# EAGLE design Small_LED_Cube (EAGLE 7.7.0)
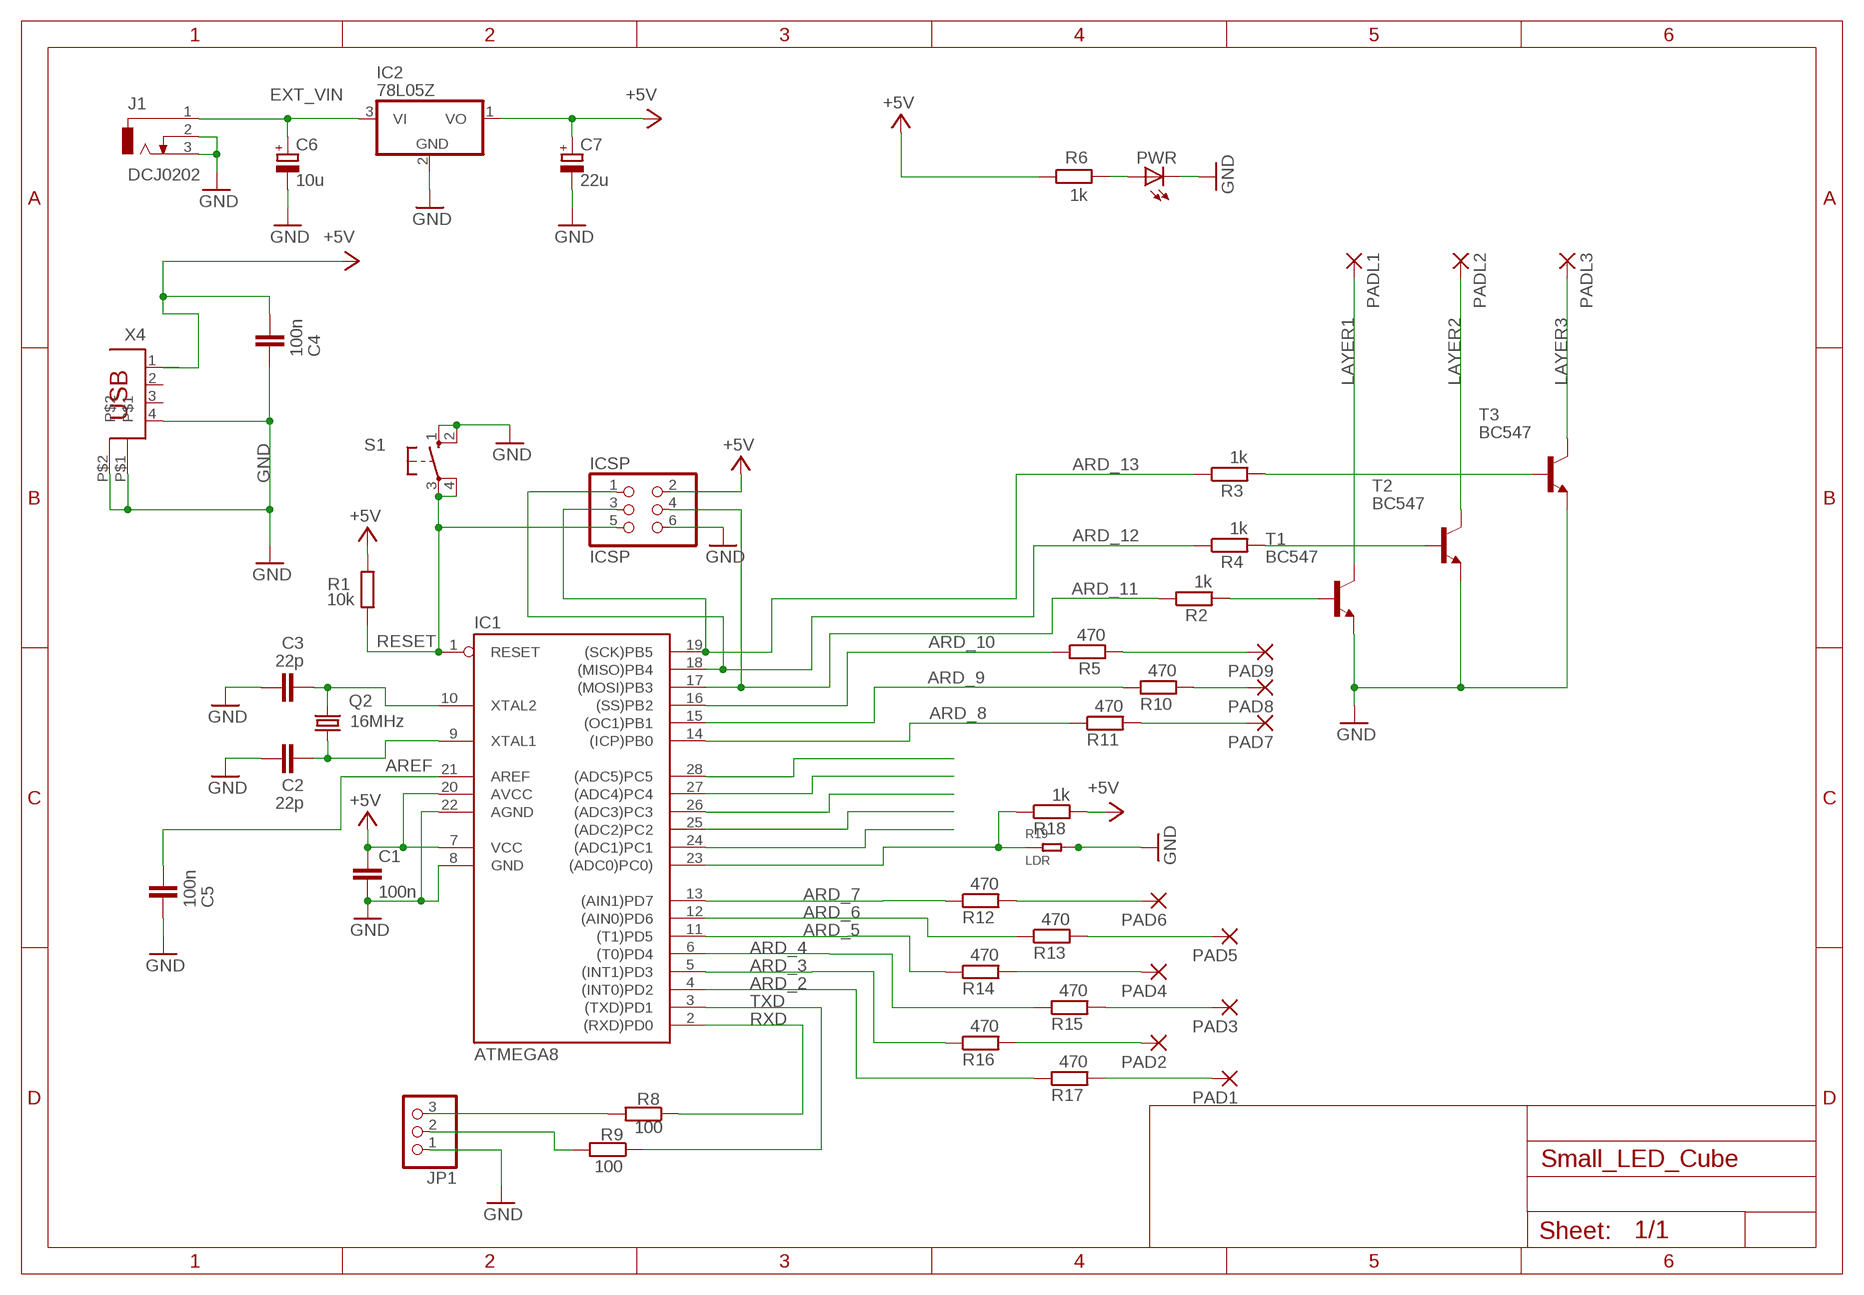
[diagram p0: schematic, sheet 1]

## Parts
C1  100n  C-EU050-025X075  [C050-025X075]
C2  22p  C-EU025-024X044  [C025-024X044]
C3  22p  C-EU025-024X044  [C025-024X044]
C4  100n  C-EU050-025X075  [C050-025X075]
C5  100n  C-EU050-025X075  [C050-025X075]
C6  10u  CPOL-EUE2.5-5  [E2,5-5]
C7  22u  CPOL-EUE2.5-5  [E2,5-5]
IC1  ATMEGA8  AT90S4433P  [DIL28-3]
IC2  78L05Z  [TO92]
ICSP  ICSP  PINHD-2X3  [2X03]
J1  DCJ0202  [DCJ0202]
JP1  PINHD-1X3  [1X03]
PAD1  1,6/0,9  [1,6/0,9]
PAD2  1,6/0,9  [1,6/0,9]
PAD3  1,6/0,9  [1,6/0,9]
PAD4  1,6/0,9  [1,6/0,9]
PAD5  1,6/0,9  [1,6/0,9]
PAD6  1,6/0,9  [1,6/0,9]
PAD7  1,6/0,9  [1,6/0,9]
PAD8  1,6/0,9  [1,6/0,9]
PAD9  1,6/0,9  [1,6/0,9]
PADL1  1,6/0,9  [1,6/0,9]
PADL2  1,6/0,9  [1,6/0,9]
PADL3  1,6/0,9  [1,6/0,9]
PWR  LED3MM  [LED3MM]
Q2  16MHz  CRYTALHC49S  [HC49/S]
R1  10k  R-EU_0204/7  [0204/7@1]
R2  1k  R-EU_0204/7  [0204/7@1]
R3  1k  R-EU_0204/7  [0204/7@1]
R4  1k  R-EU_0204/7  [0204/7@1]
R5  470  R-EU_0204/7  [0204/7@1]
R6  1k  R-EU_0204/7  [0204/7@1]
R8  100  R-EU_0204/7  [0204/7@1]
R9  100  R-EU_0204/7  [0204/7@1]
R10  470  R-EU_0204/7  [0204/7@1]
R11  470  R-EU_0204/7  [0204/7@1]
R12  470  R-EU_0204/7  [0204/7@1]
R13  470  R-EU_0204/7  [0204/7@1]
R14  470  R-EU_0204/7  [0204/7@1]
R15  470  R-EU_0204/7  [0204/7@1]
R16  470  R-EU_0204/7  [0204/7@1]
R17  470  R-EU_0204/7  [0204/7@1]
R18  1k  R-EU_0204/7  [0204/7@1]
R19  LDR  DIP-RES-LDR(2P-D2.3X3.7MM)  [PR-2.8-4.2X4.9MM]
S1  10-XX  [B3F-10XX]
T1  BC547  [TO92]
T2  BC547  [TO92]
T3  BC547  [TO92]
X4  PN61729  [PN61729]

## Nets
+5V [usbvcc]: C1.1 C4.1 C7.+ IC1.7(VCC) IC1.20(AVCC) IC2.1(VO) ICSP.2 R1.2 R6.1 R18.2 X4.1
ARD_2: IC1.4((INT0)PD2) R17.1
ARD_3: IC1.5((INT1)PD3) R16.1
ARD_4: IC1.6((T0)PD4) R15.1
ARD_5: IC1.11((T1)PD5) R14.1
ARD_6: IC1.12((AIN0)PD6) R13.1
ARD_7: IC1.13((AIN1)PD7) R12.1
ARD_8: IC1.14((ICP)PB0) R11.1
ARD_9: IC1.15((OC1)PB1) R10.1
ARD_10: IC1.16((SS)PB2) R5.1
ARD_11: IC1.17((MOSI)PB3) ICSP.4 R2.1
ARD_12: IC1.18((MISO)PB4) ICSP.1 R4.1
ARD_13: IC1.19((SCK)PB5) ICSP.3 R3.1
AREF [aref]: C5.1 IC1.21(AREF)
EXT_VIN: C6.+ IC2.3(VI) J1.1
GND [gnd]: C1.2 C2.1 C3.1 C4.2 C5.2 C6.- C7.- IC1.8(GND) IC1.22(AGND) IC2.2(GND) ICSP.6 J1.2 J1.3 JP1.1 PWR.K(C) R19.2 S1.1(S) S1.2(S1) T1.1(E) T2.1(E) T3.1(E) X4.4 X4.P$1 X4.P$2
LAYER1: PADL1.1(P) T1.3(C)
LAYER2: PADL2.1(P) T2.3(C)
LAYER3: PADL3.1(P) T3.3(C)
N$3: PWR.A R6.2
N$5: PAD9.1(P) R5.2
N$6: C2.2 IC1.9(XTAL1) Q2.1
N$7: C3.2 IC1.10(XTAL2) Q2.2
N$9: JP1.3 R8.2
N$13: PAD6.1(P) R12.2
N$14: PAD5.1(P) R13.2
N$15: PAD4.1(P) R14.2
N$16: IC1.23((ADC0)PC0)) R18.1 R19.1
N$17: IC1.24((ADC1)PC1)
N$18: IC1.25((ADC2)PC2)
N$19: IC1.26((ADC3)PC3)
N$20: IC1.27((ADC4)PC4)
N$21: IC1.28((ADC5)PC5)
N$22: PAD3.1(P) R15.2
N$23: JP1.2 R9.2
N$24: R4.2 T2.2(B)
N$25: R2.2 T1.2(B)
N$26: R3.2 T3.2(B)
N$27: PAD2.1(P) R16.2
N$28: PAD1.1(P) R17.2
N$29: PAD7.1(P) R11.2
N$30: PAD8.1(P) R10.2
RESET: IC1.1(RESET) ICSP.5 R1.1 S1.3(P) S1.4(P1)
RXD: IC1.2((RXD)PD0) R8.1
TXD: IC1.3((TXD)PD1) R9.1
Unconnected: X4.2 X4.3

## Library data of the parts
C1-C5 = rcl:C-EU: CAPACITOR, European symbol
C6 C7 = rcl:CPOL-EU: POLARIZED CAPACITOR, European symbol
IC1 = atmel:AT90S4433: MICROCONTROLLER 4 Kbytes FLASH 128 bytes SRAM 256 bytes EEPROM UART 6-channel 10 bit ADC
IC2 = linear:78*: Positive VOLTAGE REGULATOR Source: http://cache.national.com/ds/LM/LM78L05.pdf http://www.fairchildsemi.com/ds/LM/LM7805.pdf
ICSP = pinhead:PINHD-2X3: PIN HEADER
J1 = IANS:DCJ0202: DC POWER JACK Source: DCJ0202.pdf
JP1 = pinhead:PINHD-1X3: PIN HEADER
PAD1-PAD9 PADL1-PADL3 = wirepad:1,6/0,9: THROUGH-HOLE PAD
PWR = led:LED: LED OSRAM: - CHIPLED LG R971, LG N971, LY N971, LG Q971, LY Q971, LO R971, LY R971 LH N974, LH R974 LS Q976, LO Q976, LY Q976 LO Q996 - Hyper CHIPLED LW Q18S LB Q993, LB Q99A, LB R99A - SideLED LS A670, LO A670, LY A670, LG A670, LP A670 LB A673, LV A673, LT A673, LW A673 LH A674 LY A675 LS A676, LA A676, LO A676, LY A676, LW A676 LS A679, LY A679, LG A679 - Hyper Micro SIDELED® LS Y876, LA Y876, LO Y876, LY Y876 LT Y87S - SmartLED LW L88C, LW L88S LB L89C, LB L89S, LG L890 LS L89K, LO L89K, LY L89K LS L896, LA L896, LO L896, LY L896 - TOPLED LS T670, LO T670, LY T670, LG T670, LP T670 LSG T670, LSP T670, LSY T670, LOP T670, LYG T670 LG T671, LOG T671, LSG T671 LB T673, LV T673, LT T673, LW T673 LH T674 LS T676, LA T676, LO T676, LY T676, LB T676, LH T676, LSB T676, LW T676 LB T67C, LV T67C, LT T67C, LS T67K, LO T67K, LY T67K, LW E67C LS E67B, LA E67B, LO E67B, LY E67B, LB E67C, LV E67C, LT E67C LW T67C LS T679, LY T679, LG T679 LS T770, LO T770, LY T770, LG T770, LP T770 LB T773, LV T773, LT T773, LW T773 LH T774 LS E675, LA E675, LY E675, LS T675 LS T776, LA T776, LO T776, LY T776, LB T776 LHGB T686 LT T68C, LB T68C - Hyper Mini TOPLED® LB M676 - Mini TOPLED Santana® LG M470 LS M47K, LO M47K, LY M47K Source: http://www.osram.convergy.de/
Q2 = crystal:CRYTAL: CRYSTAL
R1-R6 R8-R18 = rcl:R-EU_: RESISTOR, European symbol
R19 = Seeed-OPL-Resistor:DIP-RES-LDR(2P-D2.3X3.7MM): 314120003; MPN: LDR-VT90N2
S1 = switch-omron:10-XX: OMRON SWITCH
T1-T3 = transistor:BC547: NPN TRANSISTOR
X4 = SmartPrj:PN61729: BERG USB connector

## Net classes
0 default: width 0.254 mm, drill 0.305 mm, clearance 0.152 mm
1 power: width 0.61 mm, drill 0.508 mm, clearance 0.152 mm
2 gnd: width 0.305 mm, drill 0.508 mm, clearance 0.152 mm
3 usbvcc: width 0.508 mm, drill 0.508 mm, clearance 0.152 mm
4 aref: width 0.406 mm

## Board
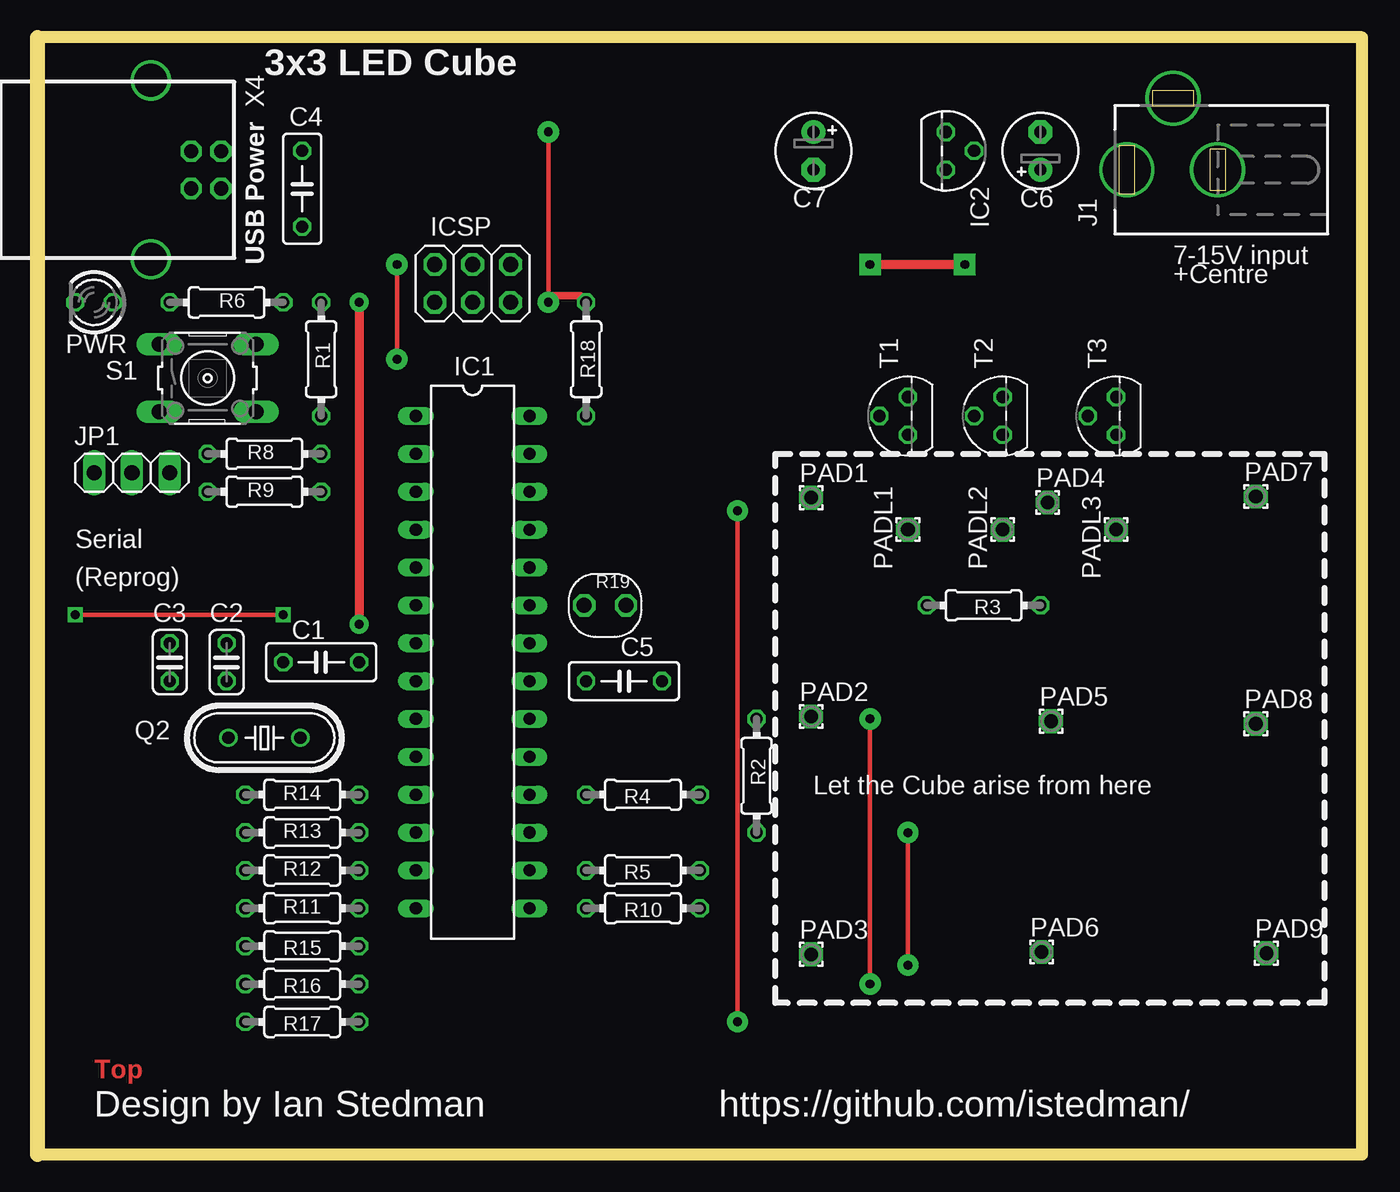
[diagram p1: board, top side]
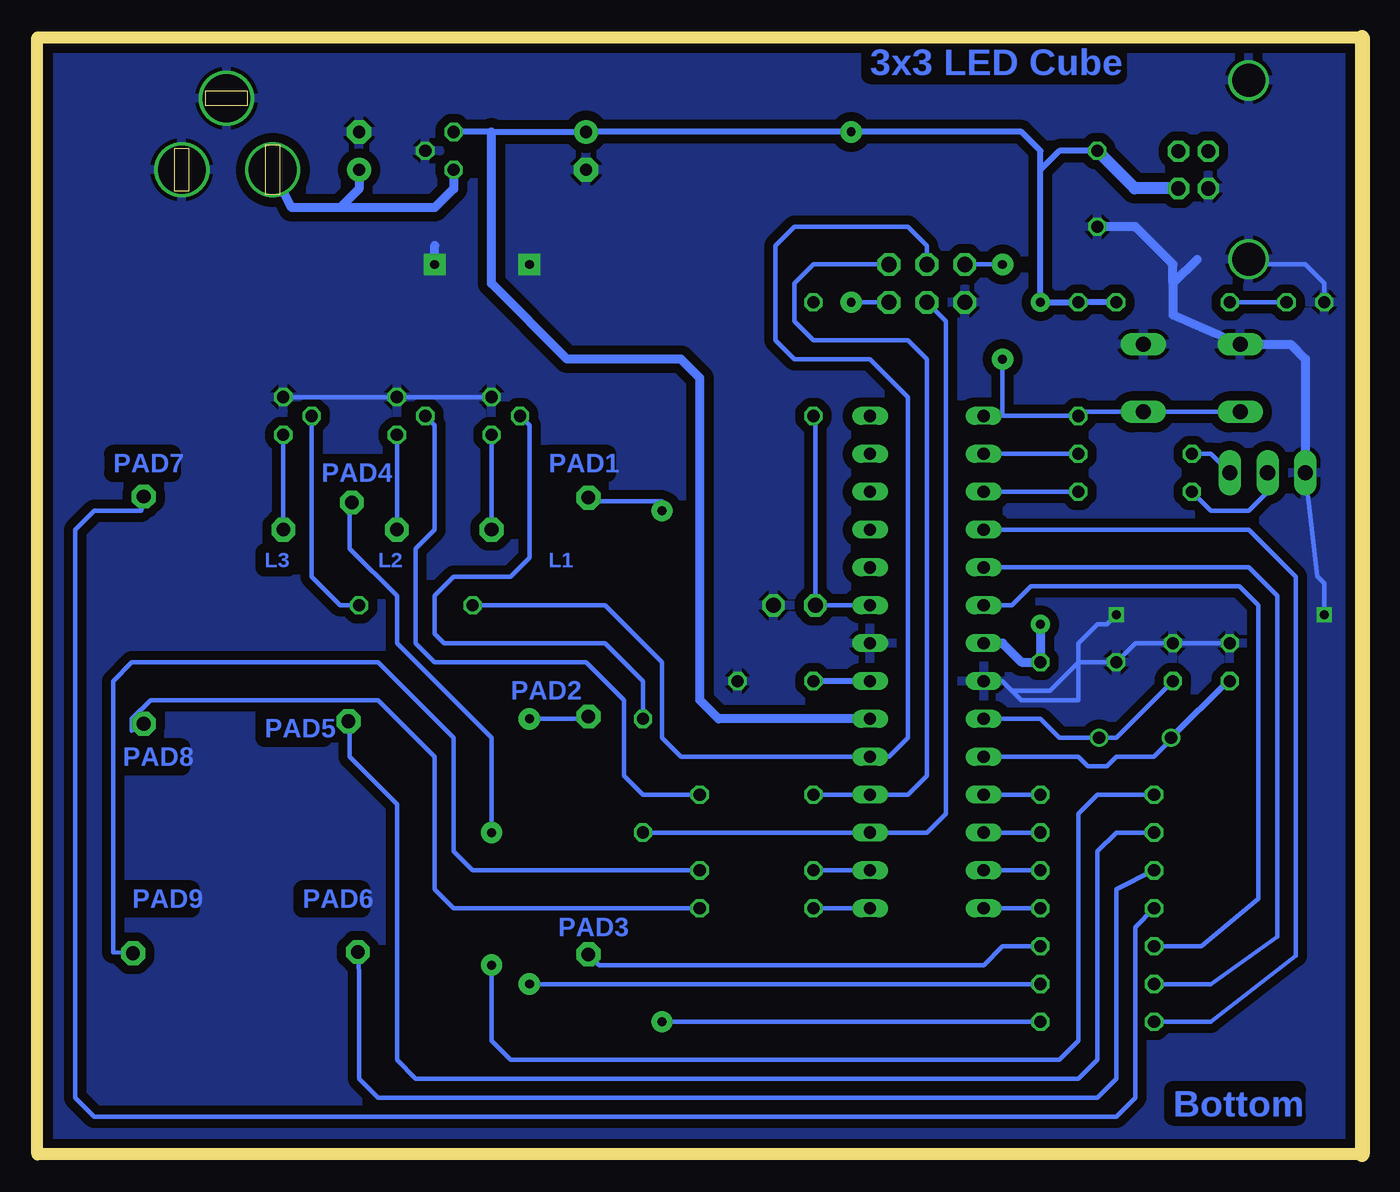
[diagram p2: board, bottom side, seen from below]

Size 88.9 x 74.93 mm. Coordinates in mm from the lower left corner, seen from the top.
Outline: 0,74.93 0,74.6 0,0 88.9,0 88.9,74.93 0,74.93
Copper layers (1*16): Top 0.035mm / dielectric 1.5mm / Bottom 0.035mm
Design rules "pcbtrainsmt": minimum track width 0.15mm, minimum drill 0.5mm, track to track 0.15mm, track to pad 0.15mm, pad to pad 0.15mm, via to via 0.15mm, smd to smd 0.15mm, copper to edge 0.5mm, drill to drill 0.5mm, minimum pad ring 5mil, minimum via ring 8mil, stop-mask expansion 0mil, vias tented up to drill 0mil, thermal gap 10mil

### Footprints (pad centres in the part's own frame; a part is rotated, then mirrored left to right if it is on the bottom)
C050-025X075 = drill 0.813 octagon: 1 -2.54,0; 2 2.54,0
C025-024X044 = drill 0.813 octagon: 1 -1.27,0; 2 1.27,0
E2,5-5 = drill 0.813 pad 1.6: + -1.27,0 | drill 0.813 pad 1.6 octagon: - 1.27,0
DIL28-3 = drill 0.813 long: 1 -16.51,-3.81; 2 -13.97,-3.81; 3 -11.43,-3.81; 4 -8.89,-3.81; 5 -6.35,-3.81; 6 -3.81,-3.81; 7 -1.27,-3.81; 8 1.27,-3.81; 9 3.81,-3.81; 10 6.35,-3.81; 11 8.89,-3.81; 12 11.43,-3.81; 13 13.97,-3.81; 14 16.51,-3.81; 15 16.51,3.81; 16 13.97,3.81; 17 11.43,3.81; 18 8.89,3.81; 19 6.35,3.81; 20 3.81,3.81; 21 1.27,3.81; 22 -1.27,3.81; 23 -3.81,3.81; 24 -6.35,3.81; 25 -8.89,3.81; 26 -11.43,3.81; 27 -13.97,3.81; 28 -16.51,3.81
TO92 = drill 0.813 octagon: 1 -1.27,0; 2 0,1.905; 3 1.27,0
2X03 = drill 1.016 octagon: 1 -2.54,-1.27; 2 -2.54,1.27; 3 0,-1.27; 4 0,1.27; 5 2.54,-1.27; 6 2.54,1.27
DCJ0202 = drill 3.2: 1 0,3.1; 2 4.8,0; 3 0,-3
1X03 = drill 1.016 long: 1 -2.54,0; 2 0,0; 3 2.54,0
1,6/0,9 = drill 0.914 pad 1.6 octagon: 1 0,0
LED3MM = drill 0.813 octagon: A -1.27,0; K 1.27,0
HC49/S = drill 0.813: 1 -2.413,0; 2 2.413,0
0204/7@1 = drill 0.813 octagon: 1 -3.81,0; 2 3.81,0
PR-2.8-4.2X4.9MM = drill 1 octagon: 1 0,-1.4; 2 0,1.4
B3F-10XX = drill 1.016 long: 1 -3.251,2.261; 2 3.251,2.261; 3 -3.251,-2.261; 4 3.251,-2.261
TO92' = drill 0.813 octagon: 1 1.27,0; 2 0,1.905; 3 -1.27,0
PN61729 = drill 0.95 octagon: 1 1.25,4.71; 2 -1.25,4.71; 3 -1.25,2.71; 4 1.25,2.71 | drill 2.2: P$1 -6,0; P$2 6,0

### Placement (x,y rotation side)
C1  19.05,33.02 180 top
C2  12.7,33.02 270 top
C3  8.89,33.02 270 top
C4  17.78,64.77 270 top
C5  39.37,31.75 0 top
C6  67.31,67.31 90 top
C7  52.07,67.31 270 top
IC1  29.21,33.02 270 top
IC2  60.96,67.31 270 top
ICSP  29.21,58.42 180 top
J1  76.2,66.04 90 top
JP1  6.35,45.72 0 top
PAD1  51.92,44.05 0 top
PAD2  51.92,29.37 0 top
PAD3  51.92,13.42 0 top
PAD4  67.79,43.73 0 top
PAD5  68.02,29.05 0 top
PAD6  67.39,13.58 0 top
PAD7  81.76,44.13 0 top
PAD8  81.76,28.89 0 top
PAD9  82.47,13.49 0 top
PADL1  58.42,41.91 0 top
PADL2  64.77,41.91 0 top
PADL3  72.39,41.91 0 top
PWR  3.81,57.15 180 top
Q2  15.24,27.94 180 top
R1  19.05,53.34 90 top
R2  48.26,25.4 90 top
R3  63.5,36.83 0 top
R4  40.64,24.13 0 top
R5  40.64,19.05 0 top
R6  12.7,57.15 180 top
R8  15.24,46.99 180 top
R9  15.24,44.45 180 top
R10  40.64,16.51 0 top
R11  17.78,16.51 180 top
R12  17.78,19.05 180 top
R13  17.78,21.59 180 top
R14  17.78,24.13 180 top
R15  17.78,13.97 0 top
R16  17.78,11.43 0 top
R17  17.78,8.89 0 top
R18  36.83,53.34 90 top
R19  38.1,36.83 270 top
S1  11.43,52.07 0 top
T1  BC547  [TO92']  58.42,49.53 90 top
T2  BC547  [TO92']  64.77,49.53 90 top
T3  BC547  [TO92']  72.39,49.53 90 top
X4  7.62,66.04 270 top

### Tracks (layer width: path | path; a pad name or v marks a point on that pad's centre or on a via)
+5V  (via drill 0.6 pad 1.27, 0.6 pad 1.42)
  Top 0.305: v34.29,57.15 v34.29,68.58
  Top 0.508: R18.2 36.46,57.6 34.46,57.6 v34.29,57.15
  Top 0.61: v21.59,57.15 v21.59,35.56
  Bottom 0.305: ICSP.2 v34.29,57.15
  Bottom 0.406: R6.1 R1.2 v21.59,57.15 21.59,66.04 | IC2.1 58.42,68.58 C7.+ v34.29,68.58 22.86,68.58 21.59,67.31 21.59,66.04 | C4.1 20.32,67.31 21.59,66.04
  Bottom 0.61: v21.59,35.56 C1.1 22.86,33.02 24.13,34.29 IC1.7 | IC1.20 43.18,29.21 44.45,30.48 44.45,52.07 45.72,53.34 53.34,53.34 58.42,58.42 58.42,68.58
  Bottom 0.813: X4.1 15.26,64.79 C4.1
ARD_2
  Bottom 0.305: IC1.4 7.62,41.91 4.45,38.74 4.45,13.34 10.16,8.89 R17.1
ARD_3
  Bottom 0.305: IC1.5 7.62,39.37 5.72,37.47 5.72,14.61 10.16,11.43 R16.1
ARD_4
  Bottom 0.305: R15.1 10.8,13.97 6.99,17.15 6.99,36.83 8.25,38.1 22.23,38.1 23.5,36.83 IC1.6
ARD_5
  Bottom 0.305: IC1.11 R14.1
ARD_6
  Bottom 0.305: IC1.12 R13.1
ARD_7
  Bottom 0.305: IC1.13 R12.1
ARD_8
  Bottom 0.305: IC1.14 R11.1
ARD_9
  Bottom 0.305: IC1.15 R10.1
ARD_10
  Bottom 0.305: IC1.16 R5.1
ARD_11
  Bottom 0.305: R2.1 IC1.17 29.21,21.59 27.94,22.86 27.94,55.88 ICSP.4
ARD_12
  Bottom 0.305: R4.1 IC1.18 30.48,24.13 29.21,25.4 29.21,53.34 30.48,54.61 36.83,54.61 38.1,55.88 38.1,58.42 36.83,59.69 ICSP.1
ARD_13
  Bottom 0.305: R3.1 50.8,36.83 46.99,33.02 46.99,27.94 45.72,26.67 IC1.19 31.75,26.67 30.48,27.94 30.48,50.8 33.02,53.34 38.1,53.34 39.37,54.61 39.37,60.96 38.1,62.23 30.48,62.23 29.21,60.96 ICSP.3
AREF
  Bottom 0.406: IC1.21 C5.1
EXT_VIN
  Bottom 0.61: IC2.3 60.96,64.77 62.23,63.5 68.58,63.5 | 68.58,63.5 71.83,63.5 J1.1 | C6.+ 67.31,64.77 68.58,63.5
GND  (via drill 0.6, 0.6 pad 1.42)
  Top 0.305: v16.51,36.2 v2.54,36.2
  Top 0.61: v55.88,59.69 v62.23,59.69
  Bottom 0.305: 23.5,31.12 20.96,31.12 19.05,33.02 C1.2 15.24,34.29 C2.1 C3.1 | 23.5,31.12 24.13,31.75 IC1.8 | PWR.K 2.54,58.42 3.81,59.69 7.27,59.69 | JP1.1 3,38.77 2.54,38.3 v2.54,36.2 | T1.1 T2.1 T3.1 | 23.5,31.12 22.86,30.48 19.05,30.48 19.05,34.29 17.78,35.56 17.14,35.56 v16.51,36.2
  Bottom 0.61: 11.08,60.04 12.7,58.42 | 12.7,58.42 12.7,56.31 S1.1 4.8,54.33 3.81,53.34 JP1.1 | 12.7,58.42 12.7,59.69 15.24,62.23 C4.2 | v62.23,59.69 62.23,60.96
  pour Bottom (isolate 0.61): 1.27,73.66 1.27,1.27 87.63,1.27 87.63,73.66
LAYER1
  Bottom 0.305: T1.3 PADL1.1
LAYER2
  Bottom 0.305: T2.3 PADL2.1
LAYER3
  Bottom 0.305: T3.3 PADL3.1
N$3
  Bottom 0.305: PWR.A R6.2
N$5
  Bottom 0.305: R5.2 59.69,19.05 60.96,20.32 60.96,27.94 66.04,33.02 82.55,33.02 83.82,31.75 83.82,13.57 PAD9.1
N$6
  Bottom 0.305: IC1.9 21.59,29.21 20.32,27.94 Q2.1 16.51,27.94 C2.2
N$7
  Bottom 0.305: Q2.2 12.83,27.81 13.97,26.67 16.51,26.67 17.14,26.04 18.41,26.04 19.05,26.67 IC1.10
  Bottom 0.406: C3.2 9.02,31.75 Q2.2
N$9
  Bottom 0.305: JP1.3 10.16,46.99 R8.2
N$13
  Bottom 0.305: R12.2 16.51,17.78 16.51,5.08 17.78,3.81 66.04,3.81 67.31,5.08 67.31,12.23 PAD6.1
N$14
  Bottom 0.305: R13.2 16.51,21.59 17.78,20.32 17.78,6.35 19.05,5.08 63.5,5.08 64.77,6.35 64.77,23.5 67.94,26.67 67.94,27.86 | 67.94,28.58 67.94,27.86 | 67.94,27.86 PAD5.1
N$15  (via drill 0.6 pad 1.42)
  Top 0.305: v58.42,21.59 v58.42,12.7
  Bottom 0.305: R14.2 17.78,24.13 19.05,22.86 19.05,7.62 20.32,6.35 57.15,6.35 58.42,7.62 v58.42,12.7 | v58.42,21.59 58.42,27.94 64.77,34.29 64.77,37.47 67.94,40.64 67.94,43.57 PAD4.1
N$16
  Bottom 0.305: IC1.23 R19.1 36.7,49.4 R18.1
N$22
  Bottom 0.305: R15.2 24.13,13.97 25.4,12.7 51.2,12.7 PAD3.1
N$23
  Bottom 0.305: JP1.2 6.35,44.45 7.62,43.18 10.16,43.18 R9.2
N$24
  Bottom 0.305: R4.2 48.26,24.13 49.53,25.4 49.53,30.48 52.07,33.02 62.23,33.02 63.5,34.29 63.5,40.64 62.23,41.91 62.23,48.9 T2.2
N$25
  Bottom 0.305: R2.2 48.26,31.75 50.8,34.29 61.6,34.29 62.23,34.93 62.23,37.47 60.96,38.74 57.15,38.74 55.88,40.01 55.88,48.9 T1.2
N$26
  Bottom 0.305: R3.2 68.58,36.83 70.48,38.74 T3.2
N$27  (via drill 0.6 pad 1.42)
  Top 0.305: v55.88,11.43 v55.88,29.21
  Bottom 0.305: R16.2 v55.88,11.43 | v55.88,29.21 52.08,29.21 PAD2.1
N$28  (via drill 0.6 pad 1.42)
  Top 0.305: v46.99,8.89 v46.99,43.18
  Bottom 0.305: R17.2 v46.99,8.89 | v46.99,43.18 46.99,43.82 51.69,43.82 PAD1.1
N$29
  Bottom 0.305: R11.2 15.24,15.24 15.24,3.81 16.51,2.54 85.09,2.54 86.36,3.81 86.36,41.91 85.09,43.18 81.91,43.18 PAD7.1
N$30
  Bottom 0.305: R10.2 60.96,16.51 62.23,17.78 62.23,26.67 66.04,30.48 81.28,30.48 82.55,29.21 82.55,28.41 PAD8.1
RESET  (via drill 0.6 pad 1.42)
  Top 0.305: v24.13,53.34 v24.13,59.69
  Bottom 0.305: 24.13,49.53 R1.1 18.77,49.81 S1.4 S1.3 | IC1.1 24.13,49.53 | 24.13,49.53 v24.13,53.34 | v24.13,59.69 ICSP.5
RXD
  Bottom 0.305: R8.1 IC1.2
TXD
  Bottom 0.305: R9.1 IC1.3

### Text on the board
Top: Top
Bottom: 3x3 LED Cube | PAD1 | PAD7 | PAD4 | L1 | L2 | L3 | PAD2 | PAD5 | PAD8 | PAD6 | PAD9 | PAD3 | Bottom
tPlace: 3x3 LED Cube | USB Power | 7-15V input | Serial | (Reprog) | Let the Cube arise from here | Design by Ian Stedman | https://github.com/istedman/
tNames: +Centre
_tNames: X4 | C4 | C7 | C6 | J1 | IC2 | R6 | R18 | PWR | ICSP | R1 | IC1 | T1 | T2 | T3 | S1 | JP1 | R8 | PAD7 | R9 | PAD1 | PAD4 | PADL1 | PADL2 | PADL3 | R19 | R3 | C3 | C2 | C1 | C5 | PAD2 | PAD5 | PAD8 | Q2 | R14 | R2 | R4 | R13 | R12 | R5 | R11 | R10 | PAD3 | PAD6 | PAD9 | R15 | R16 | R17
_tValues: ICSP